# Altium schematic sheet Sheet1.SchDoc
size Tabloid
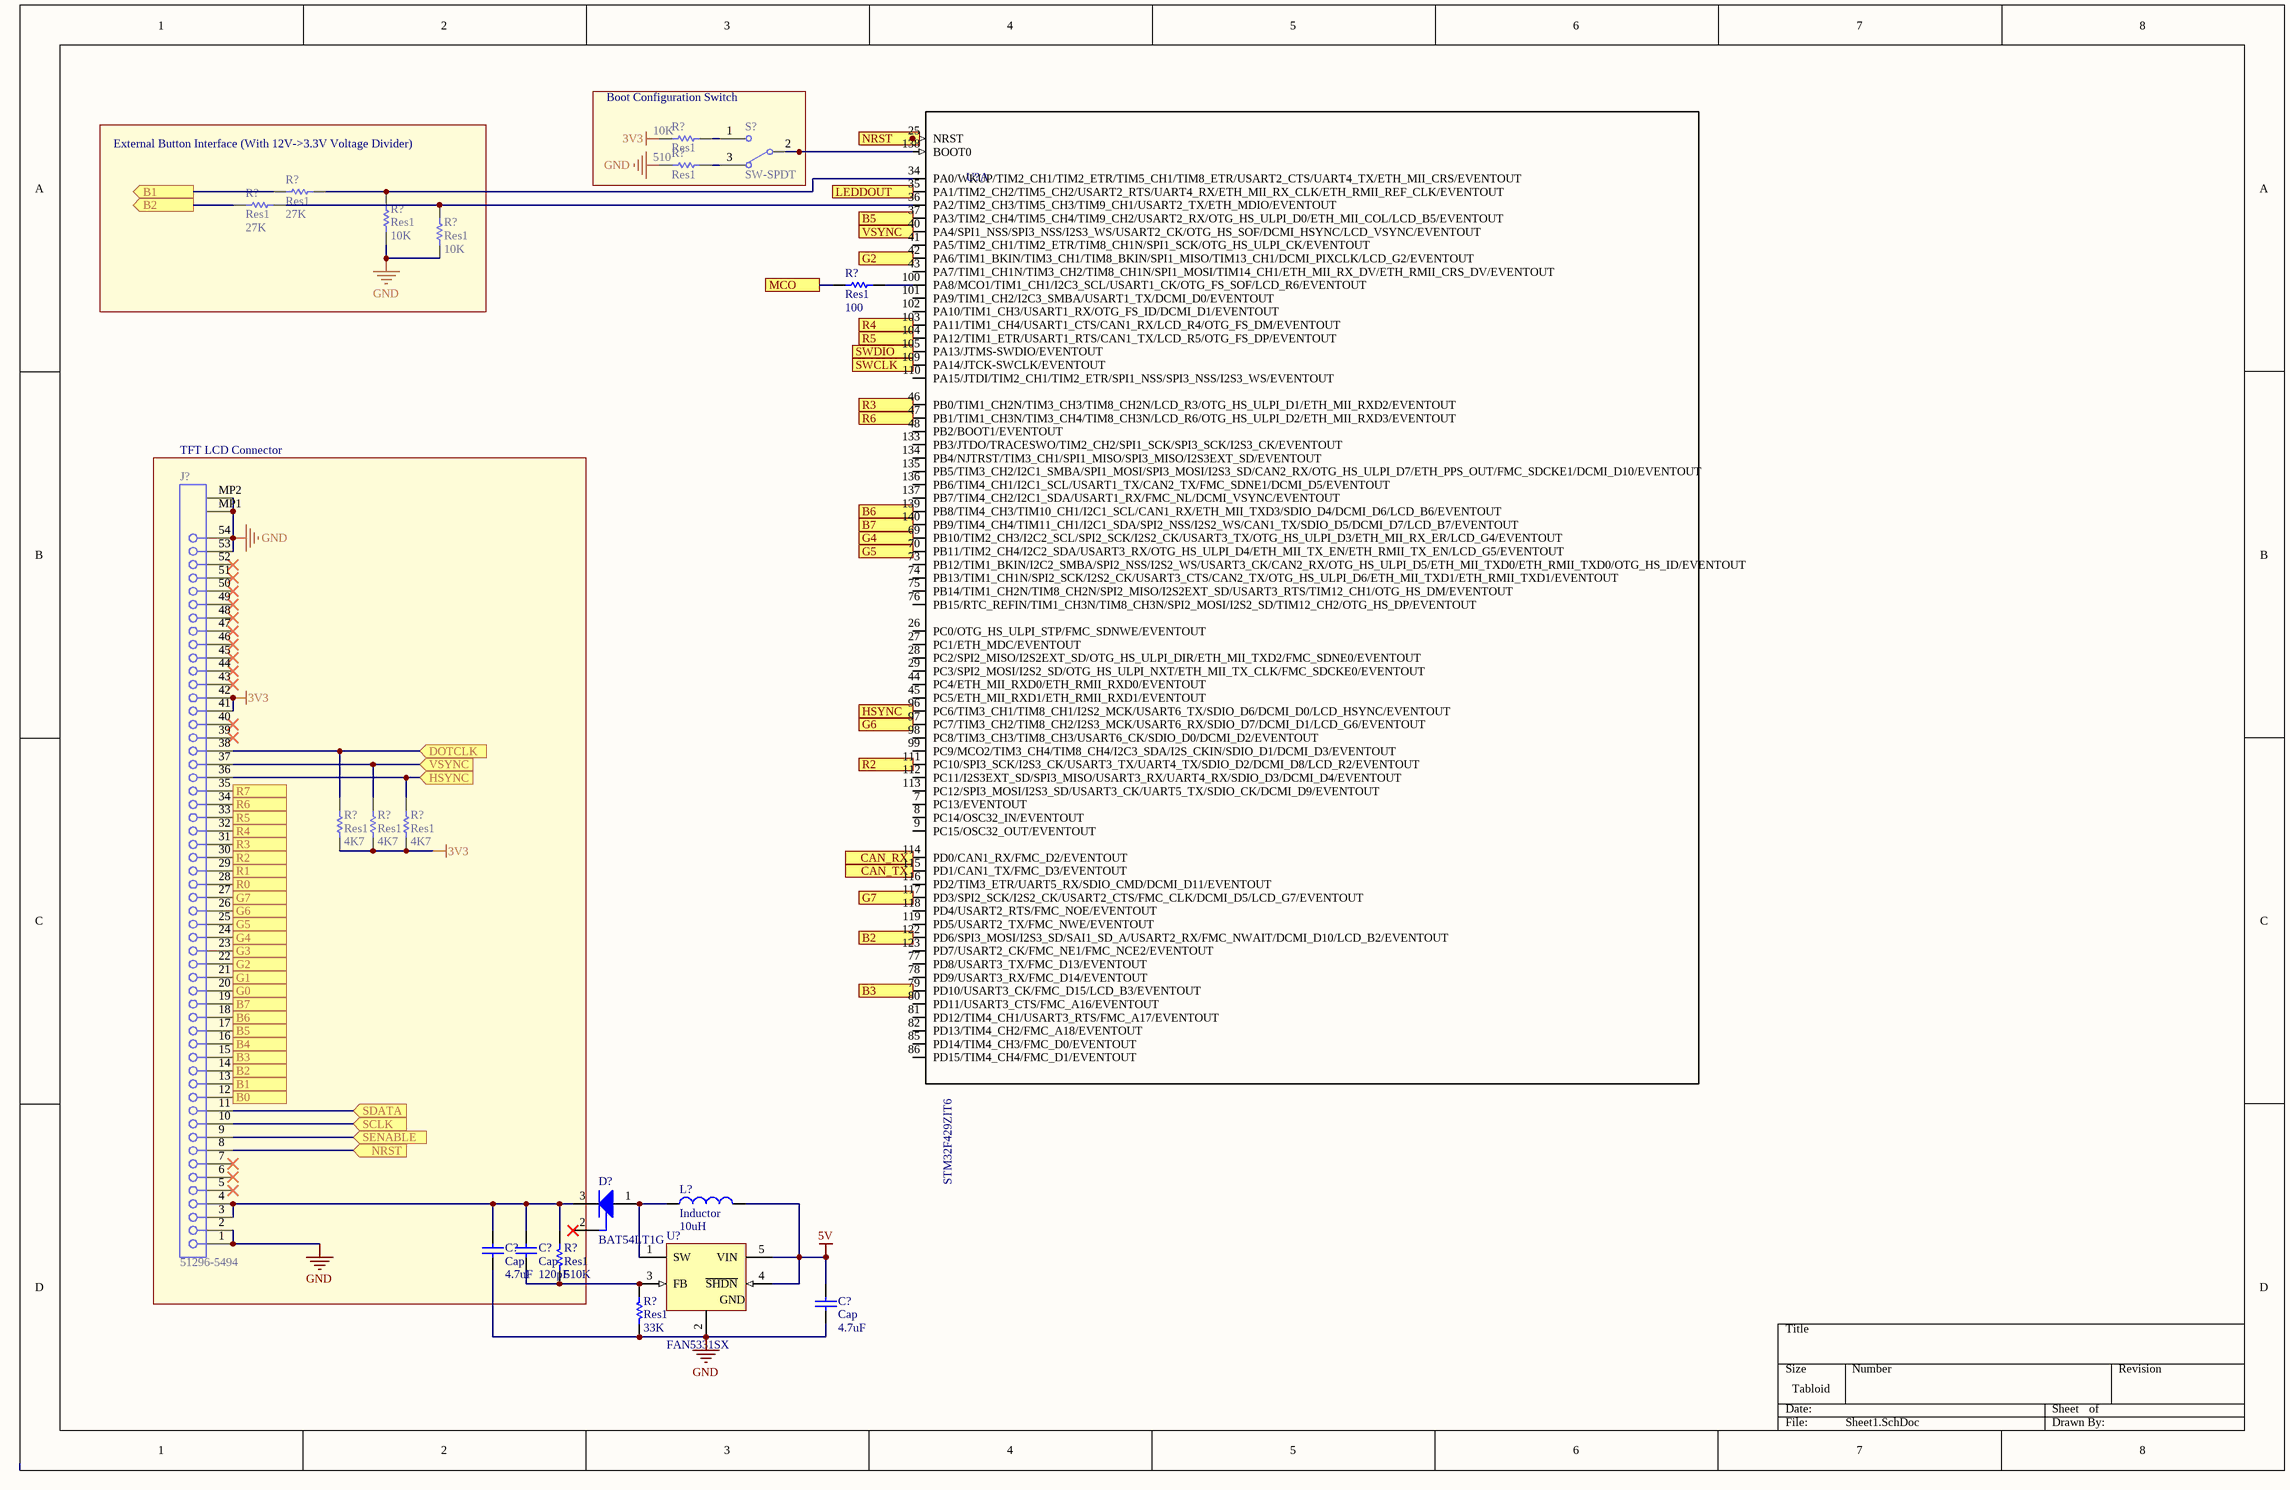
[diagram p0: Sheet1.SchDoc]

## Parts
(Parts that share a designator on the sheet are numbered #1, #2 ... from top to bottom, then left to right.)
C?#1  Cap  value 4.7uF  [RAD-0.3]
C?#2  Cap  value 120pF  [RAD-0.3]
C?#3  Cap  value 4.7uF  [RAD-0.3]
D?  BAT54LT1G  [ONSC-SOT-23-3-318-08_V]
J?  51296-5494  [MOLX-51296-5494]
L?  Inductor  value 10uH  [0402-A]
R?#1  Res1  value 10K  [AXIAL-0.3]
R?#2  Res1  value 510  [AXIAL-0.3]
R?#3  Res1  value 27K  [AXIAL-0.3]
R?#4  Res1  value 27K  [AXIAL-0.3]
R?#5  Res1  value 10K  [AXIAL-0.3]
R?#6  Res1  value 10K  [AXIAL-0.3]
R?#7  Res1  value 100  [AXIAL-0.3]
R?#8  Res1  value 4K7  [AXIAL-0.3]
R?#9  Res1  value 4K7  [AXIAL-0.3]
R?#10  Res1  value 4K7  [AXIAL-0.3]
R?#11  Res1  value 510K  [AXIAL-0.3]
R?#12  Res1  value 33K  [AXIAL-0.3]
S?  SW-SPDT  [TL36WW15050]
U?#1  STM32F429ZIT6  [*QFP50P2200X2200X160-144N]  (part A of 2)
U?#2  FAN5331SX  [DBV0005A_L]

## Blocks framed on the sheet
Boot Configuration Switch: R?#1 R?#2 S?
External Button Interface (With 12V->3.3V Voltage Divider): R?#3-R?#6
TFT LCD Connector: C?#1 C?#2 J? R?#8-R?#11

## Ports
B0 (in), B1 (in), B1 (out), B2 (in), B2 (out), B3 (in), B4 (in), B5 (in), B6 (in), B7 (in), CAN_RX, CAN_TX, DOTCLK (in), G0 (in), G1 (in), G2 (in), G3 (in), G4 (in), G5 (in), G6 (in), G7 (in), HSYNC (in), LEDDOUT, MCO, NRST (in), R0 (in), R1 (in), R2 (in), R3 (in), R4 (in), R5 (in), R6 (in), R7 (in), SCLK (in), SDATA (in), SENABLE (in), SWCLK (in), SWDIO (in), VSYNC (in)

## Nets
3V3: J?.41 J?.42 R?#1.1 R?#8.1 R?#9.1 R?#10.1
5V: C?#3.1 L?.1 U?#2.4(~{SHDN}) U?#2.5(VIN)
GND: C?#1.2 C?#3.2 J?.1 J?.2 J?.53 J?.54 J?.MP1 J?.MP2 R?#2.1 R?#5.1 R?#6.1 R?#12.1 U?#2.2(GND)
B0: J?.12 ; port B0
B1: J?.13 R?#3.2 ; port B1
B2: J?.14 R?#4.2 U?#1.122(PD6/SPI3_MOSI/I2S3_SD/SAI1_SD_A/USART2_RX/FMC_NWAIT/DCMI_D10/LCD_B2/EVENTOUT) ; port B2
B3: J?.15 U?#1.79(PD10/USART3_CK/FMC_D15/LCD_B3/EVENTOUT) ; port B3
B4: J?.16 ; port B4
B5: J?.17 U?#1.37(PA3/TIM2_CH4/TIM5_CH4/TIM9_CH2/USART2_RX/OTG_HS_ULPI_D0/ETH_MII_COL/LCD_B5/EVENTOUT) ; port B5
B6: J?.18 U?#1.139(PB8/TIM4_CH3/TIM10_CH1/I2C1_SCL/CAN1_RX/ETH_MII_TXD3/SDIO_D4/DCMI_D6/LCD_B6/EVENTOUT) ; port B6
B7: J?.19 U?#1.140(PB9/TIM4_CH4/TIM11_CH1/I2C1_SDA/SPI2_NSS/I2S2_WS/CAN1_TX/SDIO_D5/DCMI_D7/LCD_B7/EVENTOUT) ; port B7
CAN_RX: U?#1.114(PD0/CAN1_RX/FMC_D2/EVENTOUT) ; port CAN_RX
CAN_TX: U?#1.115(PD1/CAN1_TX/FMC_D3/EVENTOUT) ; port CAN_TX
DOTCLK: J?.38 R?#8.2 ; port DOTCLK
G0: J?.20 ; port G0
G1: J?.21 ; port G1
G2: J?.22 U?#1.42(PA6/TIM1_BKIN/TIM3_CH1/TIM8_BKIN/SPI1_MISO/TIM13_CH1/DCMI_PIXCLK/LCD_G2/EVENTOUT) ; port G2
G3: J?.23 ; port G3
G4: J?.24 U?#1.69(PB10/TIM2_CH3/I2C2_SCL/SPI2_SCK/I2S2_CK/USART3_TX/OTG_HS_ULPI_D3/ETH_MII_RX_ER/LCD_G4/EVENTOUT) ; port G4
G5: J?.25 U?#1.70(PB11/TIM2_CH4/I2C2_SDA/USART3_RX/OTG_HS_ULPI_D4/ETH_MII_TX_EN/ETH_RMII_TX_EN/LCD_G5/EVENTOUT) ; port G5
G6: J?.26 U?#1.97(PC7/TIM3_CH2/TIM8_CH2/I2S3_MCK/USART6_RX/SDIO_D7/DCMI_D1/LCD_G6/EVENTOUT) ; port G6
G7: J?.27 U?#1.117(PD3/SPI2_SCK/I2S2_CK/USART2_CTS/FMC_CLK/DCMI_D5/LCD_G7/EVENTOUT) ; port G7
HSYNC: J?.36 R?#10.2 U?#1.96(PC6/TIM3_CH1/TIM8_CH1/I2S2_MCK/USART6_TX/SDIO_D6/DCMI_D0/LCD_HSYNC/EVENTOUT) ; port HSYNC
LEDDOUT: U?#1.35(PA1/TIM2_CH2/TIM5_CH2/USART2_RTS/UART4_RX/ETH_MII_RX_CLK/ETH_RMII_REF_CLK/EVENTOUT) ; port LEDDOUT
MCO: R?#7.1 ; port MCO
NRST: J?.8 ; port NRST
R0: J?.28 ; port R0
R1: J?.29 ; port R1
R2: J?.30 U?#1.111(PC10/SPI3_SCK/I2S3_CK/USART3_TX/UART4_TX/SDIO_D2/DCMI_D8/LCD_R2/EVENTOUT) ; port R2
R3: J?.31 U?#1.46(PB0/TIM1_CH2N/TIM3_CH3/TIM8_CH2N/LCD_R3/OTG_HS_ULPI_D1/ETH_MII_RXD2/EVENTOUT) ; port R3
R4: J?.32 U?#1.103(PA11/TIM1_CH4/USART1_CTS/CAN1_RX/LCD_R4/OTG_FS_DM/EVENTOUT) ; port R4
R5: J?.33 U?#1.104(PA12/TIM1_ETR/USART1_RTS/CAN1_TX/LCD_R5/OTG_FS_DP/EVENTOUT) ; port R5
R6: J?.34 U?#1.47(PB1/TIM1_CH3N/TIM3_CH4/TIM8_CH3N/LCD_R6/OTG_HS_ULPI_D2/ETH_MII_RXD3/EVENTOUT) ; port R6
R7: J?.35 ; port R7
SCLK: J?.10 ; port SCLK
SDATA: J?.11 ; port SDATA
SENABLE: J?.9 ; port SENABLE
SWCLK: U?#1.109(PA14/JTCK-SWCLK/EVENTOUT) ; port SWCLK
SWDIO: U?#1.105(PA13/JTMS-SWDIO/EVENTOUT) ; port SWDIO
VSYNC: J?.37 R?#9.2 U?#1.40(PA4/SPI1_NSS/SPI3_NSS/I2S3_WS/USART2_CK/OTG_HS_SOF/DCMI_HSYNC/LCD_VSYNC/EVENTOUT) ; port VSYNC
NetC?#1_1: C?#1.1 C?#2.1 D?.3(K) J?.3 J?.4 R?#11.2
NetC?#2_2: C?#2.2 R?#11.1 R?#12.2 U?#2.3(FB)
NetD?_1: D?.1(A) L?.2 U?#2.1(SW)
NetR?#1_2: R?#1.2 S?.1
NetR?#2_2: R?#2.2 S?.3
NetR?#3_1: R?#3.1 R?#5.2 U?#1.34(PA0/WKUP/TIM2_CH1/TIM2_ETR/TIM5_CH1/TIM8_ETR/USART2_CTS/UART4_TX/ETH_MII_CRS/EVENTOUT)
NetR?#4_1: R?#4.1 R?#6.2 U?#1.36(PA2/TIM2_CH3/TIM5_CH3/TIM9_CH1/USART2_TX/ETH_MDIO/EVENTOUT)
NetR?#7_2: R?#7.2 U?#1.100(PA8/MCO1/TIM1_CH1/I2C3_SCL/USART1_CK/OTG_FS_SOF/LCD_R6/EVENTOUT)
NetS?_2: S?.2 U?#1.138(BOOT0)

Not connected (* = marked no-connect by the designer): D? 2(NC)*; J? 5* 6* 7* 39* 40* 43* 44* 45* 46* 47* 48* 49* 50* 51* 52*; U?#1 7(PC13/EVENTOUT) 8(PC14/OSC32_IN/EVENTOUT) 9(PC15/OSC32_OUT/EVENTOUT) 25(NRST) 26(PC0/OTG_HS_ULPI_STP/FMC_SDNWE/EVENTOUT) 27(PC1/ETH_MDC/EVENTOUT) 28(PC2/SPI2_MISO/I2S2EXT_SD/OTG_HS_ULPI_DIR/ETH_MII_TXD2/FMC_SDNE0/EVENTOUT) 29(PC3/SPI2_MOSI/I2S2_SD/OTG_HS_ULPI_NXT/ETH_MII_TX_CLK/FMC_SDCKE0/EVENTOUT) 41(PA5/TIM2_CH1/TIM2_ETR/TIM8_CH1N/SPI1_SCK/OTG_HS_ULPI_CK/EVENTOUT) 43(PA7/TIM1_CH1N/TIM3_CH2/TIM8_CH1N/SPI1_MOSI/TIM14_CH1/ETH_MII_RX_DV/ETH_RMII_CRS_DV/EVENTOUT) 44(PC4/ETH_MII_RXD0/ETH_RMII_RXD0/EVENTOUT) 45(PC5/ETH_MII_RXD1/ETH_RMII_RXD1/EVENTOUT) 48(PB2/BOOT1/EVENTOUT) 73(PB12/TIM1_BKIN/I2C2_SMBA/SPI2_NSS/I2S2_WS/USART3_CK/CAN2_RX/OTG_HS_ULPI_D5/ETH_MII_TXD0/ETH_RMII_TXD0/OTG_HS_ID/EVENTOUT) 74(PB13/TIM1_CH1N/SPI2_SCK/I2S2_CK/USART3_CTS/CAN2_TX/OTG_HS_ULPI_D6/ETH_MII_TXD1/ETH_RMII_TXD1/EVENTOUT) 75(PB14/TIM1_CH2N/TIM8_CH2N/SPI2_MISO/I2S2EXT_SD/USART3_RTS/TIM12_CH1/OTG_HS_DM/EVENTOUT) 76(PB15/RTC_REFIN/TIM1_CH3N/TIM8_CH3N/SPI2_MOSI/I2S2_SD/TIM12_CH2/OTG_HS_DP/EVENTOUT) 77(PD8/USART3_TX/FMC_D13/EVENTOUT) 78(PD9/USART3_RX/FMC_D14/EVENTOUT) 80(PD11/USART3_CTS/FMC_A16/EVENTOUT) 81(PD12/TIM4_CH1/USART3_RTS/FMC_A17/EVENTOUT) 82(PD13/TIM4_CH2/FMC_A18/EVENTOUT) 85(PD14/TIM4_CH3/FMC_D0/EVENTOUT) 86(PD15/TIM4_CH4/FMC_D1/EVENTOUT) 98(PC8/TIM3_CH3/TIM8_CH3/USART6_CK/SDIO_D0/DCMI_D2/EVENTOUT) 99(PC9/MCO2/TIM3_CH4/TIM8_CH4/I2C3_SDA/I2S_CKIN/SDIO_D1/DCMI_D3/EVENTOUT) 101(PA9/TIM1_CH2/I2C3_SMBA/USART1_TX/DCMI_D0/EVENTOUT) 102(PA10/TIM1_CH3/USART1_RX/OTG_FS_ID/DCMI_D1/EVENTOUT) 110(PA15/JTDI/TIM2_CH1/TIM2_ETR/SPI1_NSS/SPI3_NSS/I2S3_WS/EVENTOUT) 112(PC11/I2S3EXT_SD/SPI3_MISO/USART3_RX/UART4_RX/SDIO_D3/DCMI_D4/EVENTOUT) 113(PC12/SPI3_MOSI/I2S3_SD/USART3_CK/UART5_TX/SDIO_CK/DCMI_D9/EVENTOUT) 116(PD2/TIM3_ETR/UART5_RX/SDIO_CMD/DCMI_D11/EVENTOUT) 118(PD4/USART2_RTS/FMC_NOE/EVENTOUT) 119(PD5/USART2_TX/FMC_NWE/EVENTOUT) 123(PD7/USART2_CK/FMC_NE1/FMC_NCE2/EVENTOUT) 133(PB3/JTDO/TRACESWO/TIM2_CH2/SPI1_SCK/SPI3_SCK/I2S3_CK/EVENTOUT) 134(PB4/NJTRST/TIM3_CH1/SPI1_MISO/SPI3_MISO/I2S3EXT_SD/EVENTOUT) 135(PB5/TIM3_CH2/I2C1_SMBA/SPI1_MOSI/SPI3_MOSI/I2S3_SD/CAN2_RX/OTG_HS_ULPI_D7/ETH_PPS_OUT/FMC_SDCKE1/DCMI_D10/EVENTOUT) 136(PB6/TIM4_CH1/I2C1_SCL/USART1_TX/CAN2_TX/FMC_SDNE1/DCMI_D5/EVENTOUT) 137(PB7/TIM4_CH2/I2C1_SDA/USART1_RX/FMC_NL/DCMI_VSYNC/EVENTOUT)

## Library data of the parts
C?#1-C?#3 = Cap: Capacitor; Published: 8-Jun-2000; LatestRevisionDate: 17-Jul-2002; LatestRevisionNote: Re-released for DXP Platform.; PackageReference: RAD-0.3; Publisher: Altium Limited; PackageDescription: Radial Cap, Thru-Hole; 2 Leads; 0.3 in Pin Spacing
D? = CMP-1055-00534-1: Schottky Barrier Diode, 3-Pin SOT-23, Pb-Free, Tape and Reel; Manufacturer: On Semiconductor; IFSM Max (A): 0.6; Configuration: Single; trr Max (ns): 5; PackageVersion: Rev. AP, 11/2009; ComponentLink3Description: Package Specification; RoHS: TRUE; ComponentLink3URL: http://www.onsemi.cn/pub_link/Collateral/318-08.PDF; PackageDescription: 3-Pin Small Outline Transistor, Body 2.92 x 1.3 mm, Pitch 0.95 mm; DatasheetVersion: Rev. 12; ComponentLink1Description: Manufacturer URL; PartNumber: BAT54LT1G; ComponentLink2Description: Datasheet; Mounting Technology: Surface Mount; PackageReference: SOT-23-3-318-08; ComponentLink2URL: http://www.onsemi.cn/pub_link/Collateral/BAT54LT1-D.PDF; ComponentLink1URL: http://www.onsemi.com/; Packing: Tape and Reel
J? = CMP-1241-00166-1: 0.5 mm Pitch Easy-On(TM) Type FPC Connector, 1.3 mm Mated Height, Right Angle, ZIF, SMT, Bottom Contact, 54 Circuits, -20 to 85 degC, ELV and RoHS Compliant, Tape and Reel; Manufacturer: Molex; Entry Angle: 90degrees Angle; Pitch - Mating Interface: 0.50mm; Durability (mating cycles max): 20; Polarized to PCB: Yes; Voltage (Max): 50V AC (RMS)/DC; Material - Metal: Phosphor Bronze; Stackable: No; Mated Height: 1.30mm; Circuits (Loaded): 54; Material - Plating Termination: Gold; Current (Max per Contact): 0.5A; Contact Position: Bottom; Orientation: Right Angle; Number of Rows: 1; ComponentLink3Description: Package Specification; ComponentLink3URL: http://www.molex.com/pdm_docs/sd/512965494_sd.pdf; PackageVersion: Rev. G, 02/2011; ComponentLink1URL: http://www.molex.com/molex/index.jsp; PackageReference: 51296-5494; ComponentLink2Description: Datasheet; ComponentLink1Description: Manufacturer URL; Mounting Technology: Surface Mount; PCB Retention: Yes; PartNumber: 51296-5494; PCB Locator: No; ComponentLink2URL: http://www.molex.com/webdocs/datasheets/pdf/en-us/0512965494_FFC_FPC_CONNECTORS.pdf; PackageDescription: 54-Lead FPC Connector, Pitch 0.5 mm; Packing: Tape and Reel; Material - Plating Mating: Gold; RoHS: TRUE
L? = Inductor: Code_IEC: 1005; Published: 8-Jun-2000; LatestRevisionDate: 29-May-2009; LatestRevisionNote: IPC-7351 Footprint Added.; PackageReference: 0402-A; Publisher: Altium Limited; PackageDescription: Chip Inductor; Code_JEITA: 0402
R?#1-R?#12 = Res1: Resistor; Published: 8-Jun-2000; LatestRevisionDate: 17-Jul-2002; LatestRevisionNote: Re-released for DXP Platform.; PackageReference: AXIAL-0.3; Publisher: Altium Limited; PackageDescription: Axial Device, Thru-Hole; 2 Leads; 0.3 in Pin Spacing
S? = SW-SPDT: SPDT Subminiature Toggle Switch, Right Angle Mounting, Vertical Actuation; Published: 24-Mar-1999; LatestRevisionDate: 17-Dec-2003; LatestRevisionNote: Schematic revised, PCB Footprint replaced.; DatasheetVersion: 05-Dec-2000; PackageReference: TL36WW15050; Publisher: Altium Limited; PackageDescription: Switch; 4 Leads; ComponentLink1Description: Manufacturer Link; ComponentLink1URL: http://www.apem.com
U?#1 = STM32F429ZIT6: High-performance and DSP with FPU, ARM Cortex-M4 MCU with 2 Mbytes Flash, 180 MHz CPU, Art Accelerator, SDRAM, TFT; MF: STMicroelectronics; Digi-Key_Part_Number: 497-14053-ND; SnapEDA_Link: https://www.snapeda.com/parts/STM32F429ZIT6/STMicroelectronics/view-part/?ref=snap; MP: STM32F429ZIT6; Package: LQFP-144 STMicroelectronics; Digi-Key_Purchase_URL: https://www.digikey.com/product-detail/en/stmicroelectronics/STM32F429ZIT6/497-14053-ND/4357427?utm_source=snapeda&utm_medium=aggregator&utm_campaign=symbol; Value: *
U?#2 = CMP-0063-01104-3: Manufacturer: Texas Instruments; PackageTopMarking: S59B*XTT; CompType: MiscPower; PowerWise: N; ComponentLink1Description: Datasheet URL; ComponentLink1URL: http://www.ti.com/general/docs/lit/getliterature.tsp?genericPartNumber=LM2705&fileType=pdf; PinCount: 5; PackageDescription: Molded SOT-23, .115 x .063 x .040 in Body, 5 Lead, .0375 in Pitch; PackageReference: DBV0005A; RoHS: Y